# EAGLE design SerialCF (EAGLE 8.0.0)
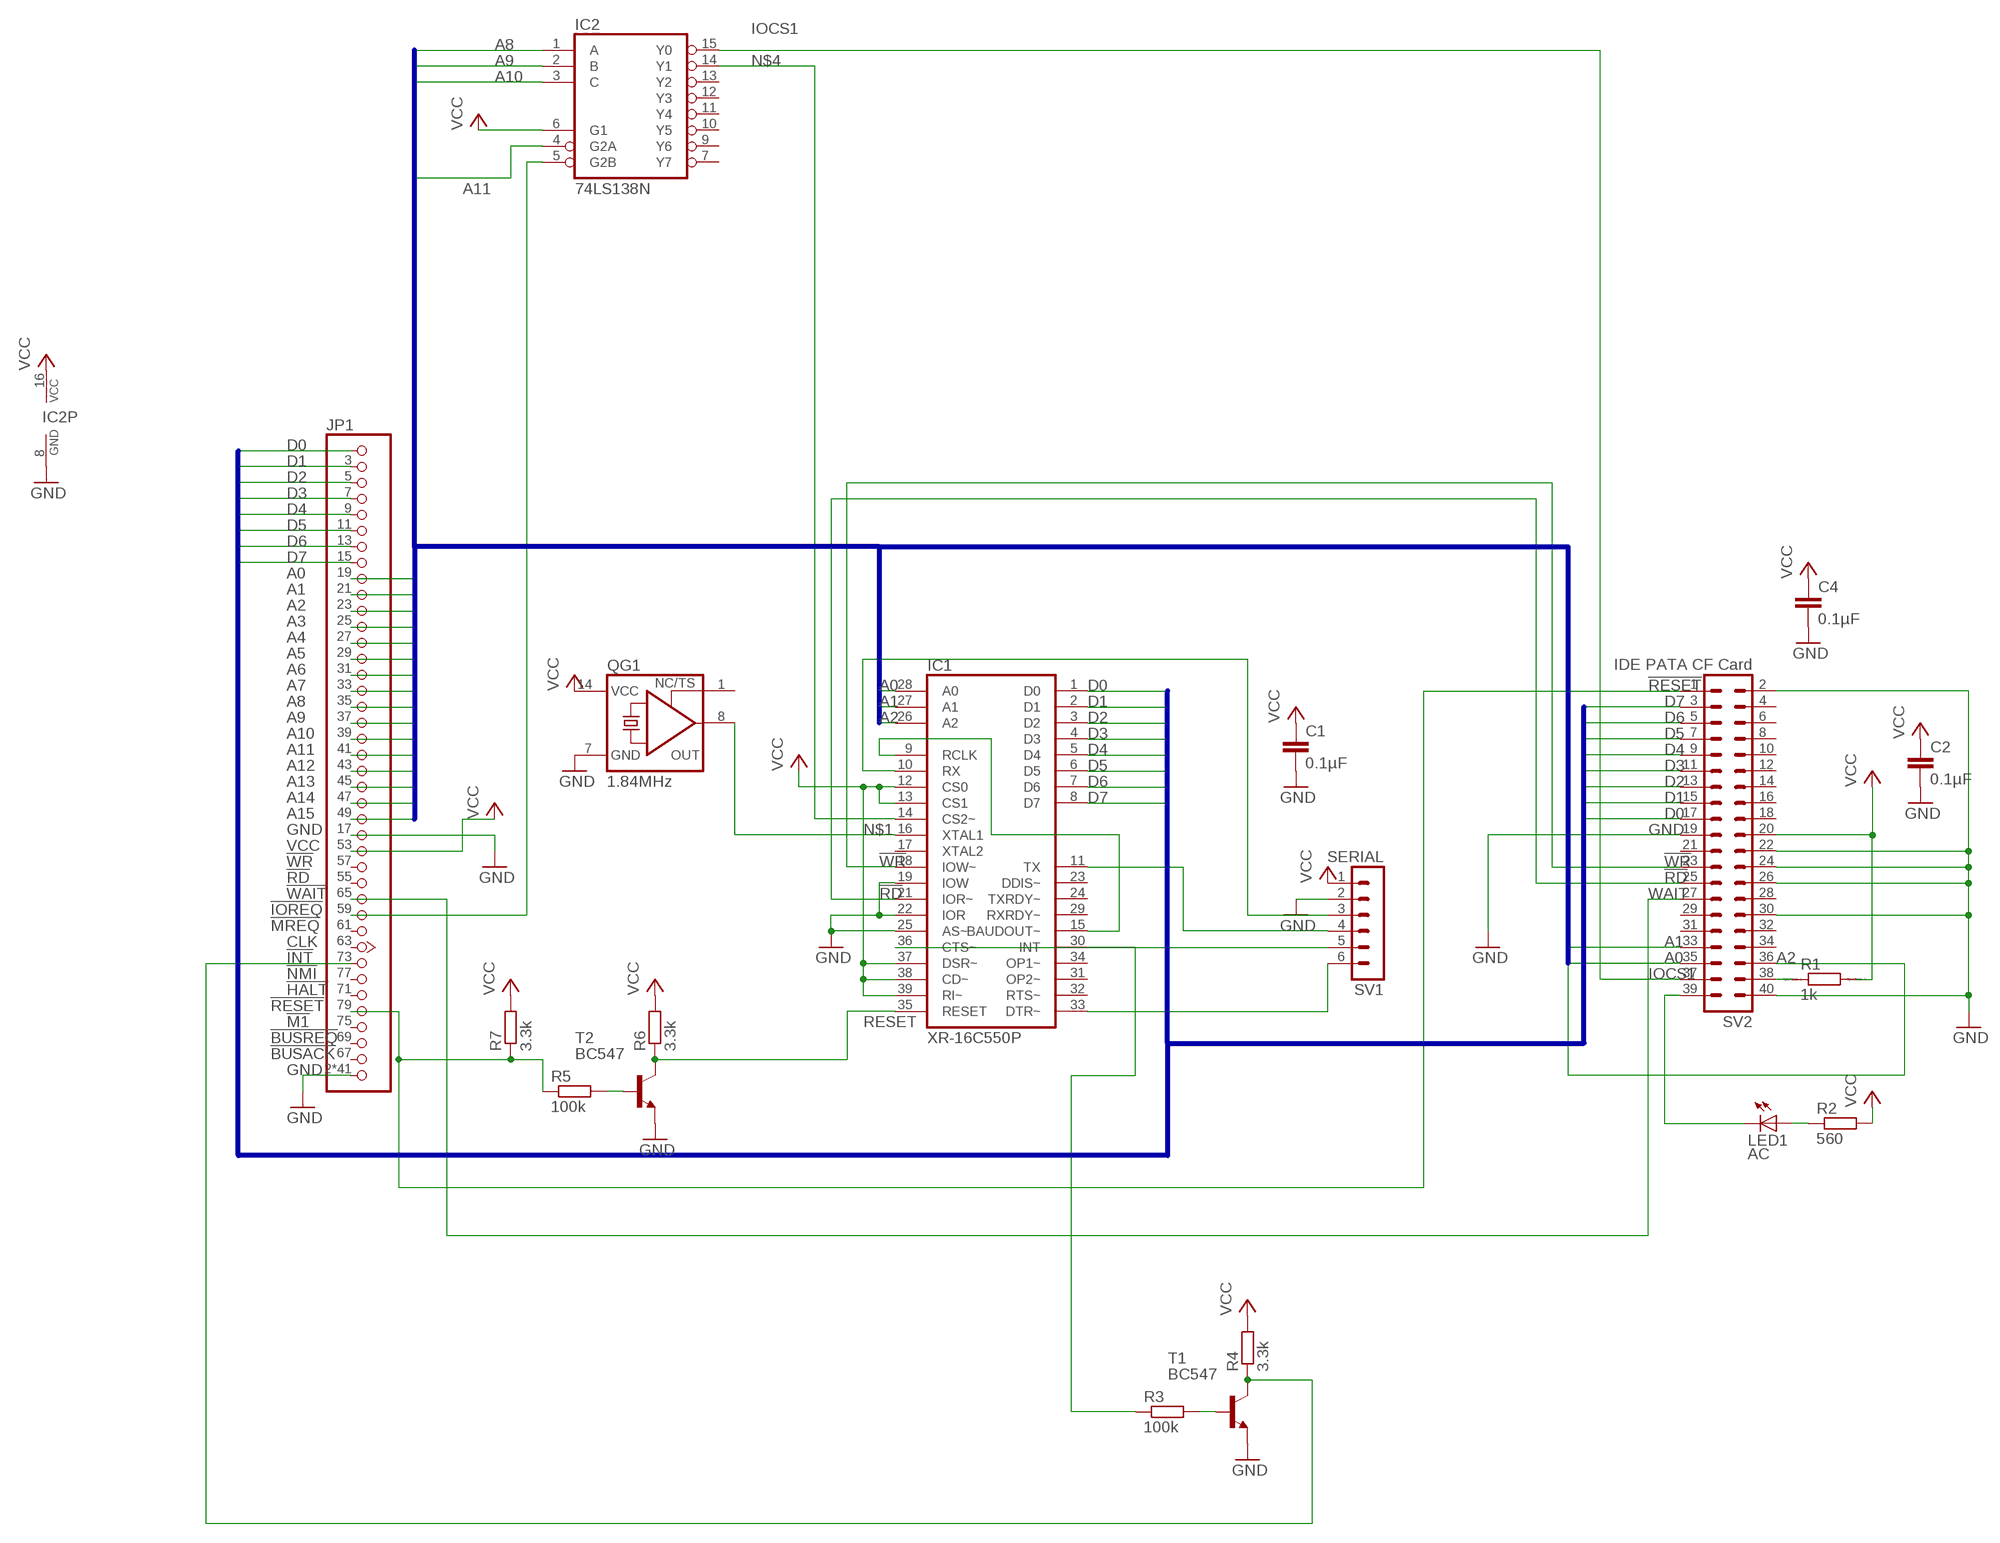
[diagram p0: schematic, sheet 1]

## Parts
C1  0.1µF  C5/2.5  [C5B2.5]
C2  0.1µF  C5/2.5  [C5B2.5]
C4  0.1µF  C5/2.5  [C5B2.5]
IC1  XR-16C550P  [DIL40]
IC2  74LS138N  [DIL16]
JP1  JEANNECTOR/90  [2X25/90]
LED1  AC  LED5MM  [LED5MM]
QG1  1.84MHz  XO-14  [DIL14S]
R1  1k  R0207/10  [0207/10]
R2  560  R-EU_0204/7  [0204/7]
R3  100k  R-EU_0207/2V  [0207/2V]
R4  3.3k  R-EU_0207/2V  [0207/2V]
R5  100k  R-EU_0207/2V  [0207/2V]
R6  3.3k  R-EU_0207/2V  [0207/2V]
R7  3.3k  R-EU_0207/2V  [0207/2V]
SV1  SERIAL  MA06-1  [MA06-1]
SV2  IDE PATA CF Card  MA20-2  [MA20-2]
T1  BC547  [TO92]
T2  BC547  [TO92]

## Nets
!RD: IC1.21(IOR~) SV2.25
!RESET: JP1.79(!RESET) R7.1 SV2.1
!WR: IC1.18(IOW~) SV2.23
A0: IC1.28(A0) JP1.19(A0) SV2.35
A1: IC1.27(A1) JP1.21(A1) SV2.33
A2: IC1.26(A2) JP1.23(A2) SV2.36
A3: JP1.25(A3)
A4: JP1.27(A4)
A5: JP1.29(A5)
A6: JP1.31(A6)
A7: JP1.33(A7)
A8: IC2.1(A) JP1.35(A8)
A9: IC2.2(B) JP1.37(A9)
A10: IC2.3(C) JP1.39(A10)
A11: IC2.4(G2A) JP1.41(A11)
A12: JP1.43(A12)
A13: JP1.45(A13)
A14: JP1.47(A14)
A15: JP1.49(A15)
D0: IC1.1(D0) JP1.1(D0) SV2.17
D1: IC1.2(D1) JP1.3(D1) SV2.15
D2: IC1.3(D2) JP1.5(D2) SV2.13
D3: IC1.4(D3) JP1.7(D3) SV2.11
D4: IC1.5(D4) JP1.9(D4) SV2.9
D5: IC1.6(D5) JP1.11(D5) SV2.7
D6: IC1.7(D6) JP1.13(D6) SV2.5
D7: IC1.8(D7) JP1.15(D7) SV2.3
GND: C1.2 C2.2 C4.2 IC1.19(IOW) IC1.22(IOR) IC1.25(AS~) IC2.8(GND) JP1.2(GND) JP1.4(GND) JP1.6(GND) JP1.8(GND) JP1.10(GND) JP1.12(GND) JP1.14(GND) JP1.16(GND) JP1.17(GND) JP1.18(GND) JP1.20(GND) JP1.22(GND) JP1.24(GND) JP1.26(GND) JP1.28(GND) JP1.30(GND) JP1.32(GND) JP1.34(GND) JP1.36(GND) JP1.38(GND) JP1.40(GND) JP1.42(GND) JP1.44(GND) JP1.46(GND) JP1.48(GND) JP1.50(GND) JP1.51(GND) JP1.52(GND) JP1.54(GND) JP1.56(GND) JP1.58(GND) JP1.60(GND) JP1.62(GND) JP1.64(GND) JP1.66(GND) JP1.68(GND) JP1.70(GND) JP1.72(GND) JP1.74(GND) JP1.76(GND) JP1.78(GND) JP1.80(GND) QG1.7(GND) SV1.2 SV2.2 SV2.19 SV2.22 SV2.24 SV2.26 SV2.30 SV2.40 T1.1(E) T2.1(E)
IOCS1: IC2.15(Y0) SV2.37
N$1: IC1.16(XTAL1) QG1.8(OUT)
N$2: LED1.K(C) SV2.39
N$3: LED1.A R2.1
N$4: IC1.14(CS2~) IC2.14(Y1)
N$5: IC2.5(G2B) JP1.59(!IOREQ)
N$6: R5.2 T2.2(B)
N$7: R6.1 T2.3(C)
N$8: R3.2 T1.2(B)
N$9: JP1.73(!INT) R4.1 T1.3(C)
N$10: IC1.30(INT) R3.1
N$11: IC1.11(TX) SV1.4
N$12: IC1.36(CTS~) SV1.5
N$13: IC1.9(RCLK) IC1.15(BAUDOUT~)
N$14: IC1.33(DTR~) SV1.6
N$15: IC1.10(RX) SV1.3
N$20: R1.1 SV2.38
RESET: IC1.35(RESET)
VCC: C1.1 C2.1 C4.1 IC1.12(CS0) IC1.13(CS1) IC1.37(DSR~) IC1.38(CD~) IC1.39(RI~) IC2.6(G1) IC2.16(VCC) JP1.53(VCC) QG1.14(VCC) R1.2 R2.2 R4.2 R6.2 R7.2 SV1.1 SV2.20
WAIT: JP1.65(!WAIT) SV2.27
Unconnected: IC1.17(XTAL2) IC1.23(DDIS~) IC1.24(TXRDY~) IC1.29(RXRDY~) IC1.31(OP2~) IC1.32(RTS~) IC1.34(OP1~) IC2.7(Y7) IC2.9(Y6) IC2.10(Y5) IC2.11(Y4) IC2.12(Y3) IC2.13(Y2) JP1.55(!RD) JP1.57(!WR) JP1.61(!MREQ) JP1.63(CLK) JP1.67(!BUSACK) JP1.69(!BUSRQ) JP1.71(!HALT) JP1.75(!M1) JP1.77(!NMI) QG1.1(TS) R5.1 SV2.4 SV2.6 SV2.8 SV2.10 SV2.12 SV2.14 SV2.16 SV2.18 SV2.21 SV2.28 SV2.29 SV2.31 SV2.32 SV2.34

## Buses
A[0..15]
D[0..7]

## Power pins joined to a net without a drawn wire
GND: IC1.20(GND)
VCC: IC1.40(VCC)

## Library data of the parts
C1 C2 C4 = capacitor-wima:C: CAPACITOR naming: grid - package width
IC1 = exar:XR-16C550P: UART/FIFO; OC_FARNELL: unknown; OC_NEWARK: 24R1445
IC2 = 74xx-eu:74*138: 3-line to 8-line DECODER/DEMULTIPLEXER
JP1 = jean:JEANNECTOR: PIN HEADER
LED1 = led:LED: LED OSRAM: - CHIPLED LG R971, LG N971, LY N971, LG Q971, LY Q971, LO R971, LY R971 LH N974, LH R974 LS Q976, LO Q976, LY Q976 LO Q996 - Hyper CHIPLED LW Q18S LB Q993, LB Q99A, LB R99A - SideLED LS A670, LO A670, LY A670, LG A670, LP A670 LB A673, LV A673, LT A673, LW A673 LH A674 LY A675 LS A676, LA A676, LO A676, LY A676, LW A676 LS A679, LY A679, LG A679 - Hyper Micro SIDELED® LS Y876, LA Y876, LO Y876, LY Y876 LT Y87S - SmartLED LW L88C, LW L88S LB L89C, LB L89S, LG L890 LS L89K, LO L89K, LY L89K LS L896, LA L896, LO L896, LY L896 - TOPLED LS T670, LO T670, LY T670, LG T670, LP T670 LSG T670, LSP T670, LSY T670, LOP T670, LYG T670 LG T671, LOG T671, LSG T671 LB T673, LV T673, LT T673, LW T673 LH T674 LS T676, LA T676, LO T676, LY T676, LB T676, LH T676, LSB T676, LW T676 LB T67C, LV T67C, LT T67C, LS T67K, LO T67K, LY T67K, LW E67C LS E67B, LA E67B, LO E67B, LY E67B, LB E67C, LV E67C, LT E67C LW T67C LS T679, LY T679, LG T679 LS T770, LO T770, LY T770, LG T770, LP T770 LB T773, LV T773, LT T773, LW T773 LH T774 LS E675, LA E675, LY E675, LS T675 LS T776, LA T776, LO T776, LY T776, LB T776 LHGB T686 LT T68C, LB T68C - Hyper Mini TOPLED® LB M676 - Mini TOPLED Santana® LG M470 LS M47K, LO M47K, LY M47K Source: http://www.osram.convergy.de LUXEON: - LUMILED® LXK2-PW12-R00, LXK2-PW12-S00, LXK2-PW14-U00, LXK2-PW14-V00 LXK2-PM12-R00, LXK2-PM12-S00, LXK2-PM14-U00 LXK2-PE12-Q00, LXK2-PE12-R00, LXK2-PE12-S00, LXK2-PE14-T00, LXK2-PE14-U00 LXK2-PB12-K00, LXK2-PB12-L00, LXK2-PB12-M00, LXK2-PB14-N00, LXK2-PB14-P00, LXK2-PB14-Q00 LXK2-PR12-L00, LXK2-PR12-M00, LXK2-PR14-Q00, LXK2-PR14-R00 LXK2-PD12-Q00, LXK2-PD12-R00, LXK2-PD12-S00 LXK2-PH12-R00, LXK2-PH12-S00 LXK2-PL12-P00, LXK2-PL12-Q00, LXK2-PL12-R00 Source: www.luxeon.com KINGBRIGHT: KA-3528ASYC Source: www.kingbright.com
QG1 = crystal:XO-: CRYSTAL; OC_FARNELL: unknown; OC_NEWARK: unknown
R1 = eagle-ltspice:R: RESISTOR, European symbol; MF: MULTICOMP; MPN: MCRE000037; OC_FARNELL: 1700237; SPICEMODEL: NONE; SPICEPREFIX: R
R2-R7 = resistor:R-EU_: RESISTOR, European symbol
SV1 = con-lstb:MA06-1: PIN HEADER; OC_FARNELL: unknown; OC_NEWARK: unknown
SV2 = con-lstb:MA20-2: PIN HEADER; OC_FARNELL: unknown; OC_NEWARK: unknown
T1 T2 = transistor:BC547: NPN TRANSISTOR

## Board
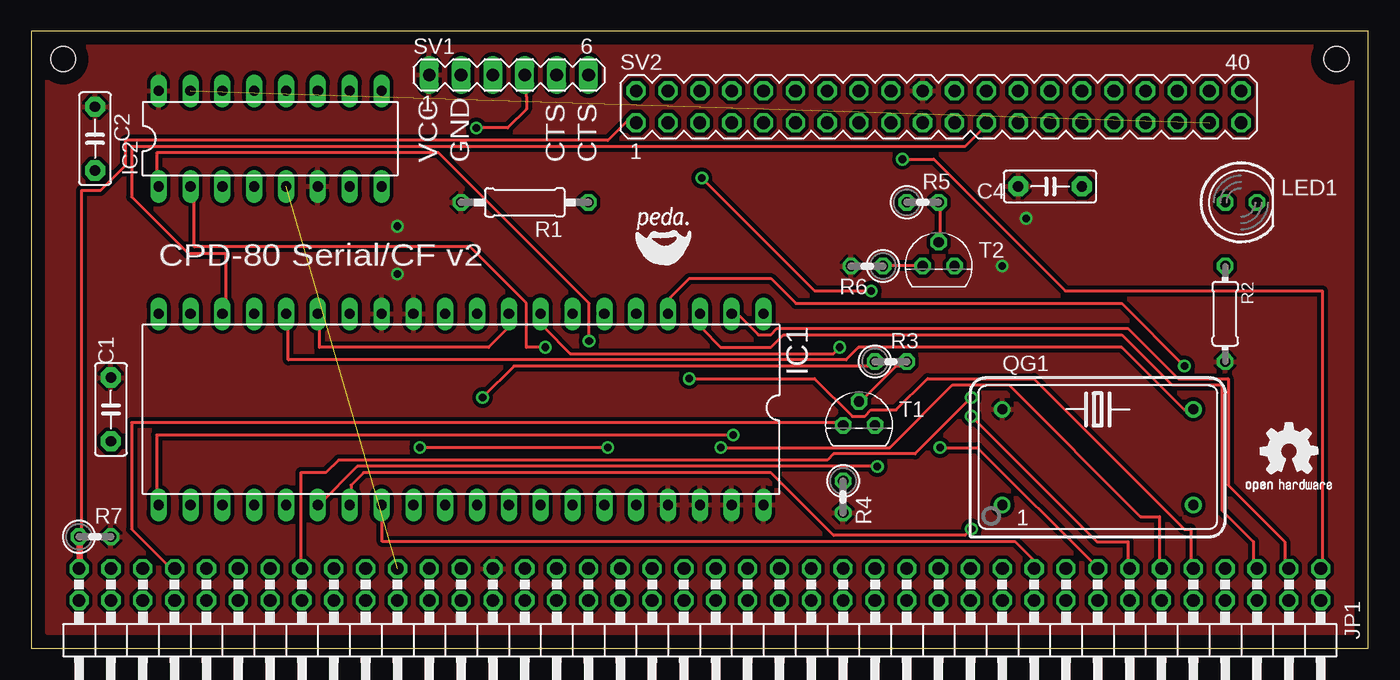
[diagram p1: board, top side]
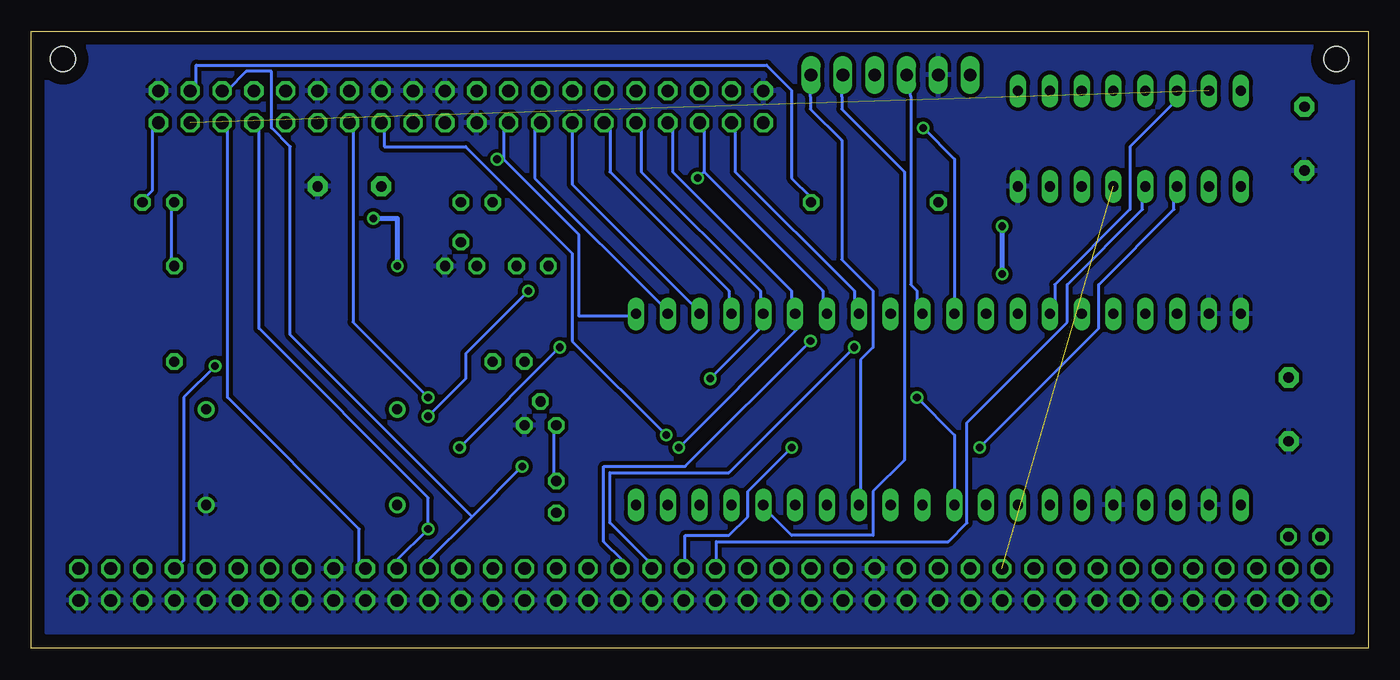
[diagram p2: board, bottom side, seen from below]

Size 106.66 x 49.2 mm. Coordinates in mm from the lower left corner, seen from the top.
Outline: 0,0 106.66,0 106.66,49.2 0,49.2 0,0
Copper layers (1*16): Top 0.035mm / dielectric 1.5mm / Bottom 0.035mm
Design rules "default": minimum track width 10mil, minimum drill 24mil, track to track 8mil, track to pad 8mil, pad to pad 8mil, via to via 8mil, smd to smd 8mil, copper to edge 40mil, drill to drill 8mil, minimum pad ring 10mil, minimum via ring 8mil, stop-mask expansion 4mil, vias tented up to drill 0mil, thermal gap 10mil
Holes 2 mm at 2.54,46.99 104.14,46.99

### Footprints (pad centres in the part's own frame; a part is rotated, then mirrored left to right if it is on the bottom)
C5B2.5 = drill 0.813 pad 1.6 octagon: 1 -2.54,0; 2 2.54,0
DIL40 = drill 0.813 long: 1 -24.13,-7.62; 2 -21.59,-7.62; 3 -19.05,-7.62; 4 -16.51,-7.62; 5 -13.97,-7.62; 6 -11.43,-7.62; 7 -8.89,-7.62; 8 -6.35,-7.62; 9 -3.81,-7.62; 10 -1.27,-7.62; 11 1.27,-7.62; 12 3.81,-7.62; 13 6.35,-7.62; 14 8.89,-7.62; 15 11.43,-7.62; 16 13.97,-7.62; 17 16.51,-7.62; 18 19.05,-7.62; 19 21.59,-7.62; 20 24.13,-7.62; 21 24.13,7.62; 22 21.59,7.62; 23 19.05,7.62; 24 16.51,7.62; 25 13.97,7.62; 26 11.43,7.62; 27 8.89,7.62; 28 6.35,7.62; 29 3.81,7.62; 30 1.27,7.62; 31 -1.27,7.62; 32 -3.81,7.62; 33 -6.35,7.62; 34 -8.89,7.62; 35 -11.43,7.62; 36 -13.97,7.62; 37 -16.51,7.62; 38 -19.05,7.62; 39 -21.59,7.62; 40 -24.13,7.62
DIL16 = drill 0.813 long: 1 -8.89,-3.81; 2 -6.35,-3.81; 3 -3.81,-3.81; 4 -1.27,-3.81; 5 1.27,-3.81; 6 3.81,-3.81; 7 6.35,-3.81; 8 8.89,-3.81; 9 8.89,3.81; 10 6.35,3.81; 11 3.81,3.81; 12 1.27,3.81; 13 -1.27,3.81; 14 -3.81,3.81; 15 -6.35,3.81; 16 -8.89,3.81
2X25/90 = drill 1.016 octagon: 1 -29.21,-6.35; 2 -29.21,-3.81; 3 -26.67,-6.35; 4 -26.67,-3.81; 5 -24.13,-6.35; 6 -24.13,-3.81; 7 -21.59,-6.35; 8 -21.59,-3.81; 9 -19.05,-6.35; 10 -19.05,-3.81; 11 -16.51,-6.35; 12 -16.51,-3.81; 13 -13.97,-6.35; 14 -13.97,-3.81; 15 -11.43,-6.35; 16 -11.43,-3.81; 17 -8.89,-6.35; 18 -8.89,-3.81; 19 -6.35,-6.35; 20 -6.35,-3.81; 21 -3.81,-6.35; 22 -3.81,-3.81; 23 -1.27,-6.35; 24 -1.27,-3.81; 25 1.27,-6.35; 26 1.27,-3.81; 27 3.81,-6.35; 28 3.81,-3.81; 29 6.35,-6.35; 30 6.35,-3.81; 31 8.89,-6.35; 32 8.89,-3.81; 33 11.43,-6.35; 34 11.43,-3.81; 35 13.97,-6.35; 36 13.97,-3.81; 37 16.51,-6.35; 38 16.51,-3.81; 39 19.05,-6.35; 40 19.05,-3.81; 41 21.59,-6.35; 42 21.59,-3.81; 43 24.13,-6.35; 44 24.13,-3.81; 45 26.67,-6.35; 46 26.67,-3.81; 47 29.21,-6.35; 48 29.21,-3.81; 49 31.75,-6.35; 50 31.75,-3.81; 51 34.29,-6.35; 52 34.29,-3.81; 53 36.83,-6.35; 54 36.83,-3.81; 55 39.37,-6.35; 56 39.37,-3.81; 57 41.91,-6.35; 58 41.91,-3.81; 59 44.45,-6.35; 60 44.45,-3.81; 61 46.99,-6.35; 62 46.99,-3.81; 63 49.53,-6.35; 64 49.53,-3.81; 65 52.07,-6.35; 66 52.07,-3.81; 67 54.61,-6.35; 68 54.61,-3.81; 69 57.15,-6.35; 70 57.15,-3.81; 71 59.69,-6.35; 72 59.69,-3.81; 73 62.23,-6.35; 74 62.23,-3.81; 75 64.77,-6.35; 76 64.77,-3.81; 77 67.31,-6.35; 78 67.31,-3.81; 79 69.85,-6.35; 80 69.85,-3.81
LED5MM = drill 0.813 octagon: A -1.27,0; K 1.27,0
DIL14S = drill 0.813: 1 -7.62,-3.81; 7 7.62,-3.81; 8 7.62,3.81; 14 -7.62,3.81
0207/10 = drill 0.813 octagon: 1 -5.08,0; 2 5.08,0
0204/7 = drill 0.813 octagon: 1 -3.81,0; 2 3.81,0
0207/2V = drill 0.813 octagon: 1 -1.27,0; 2 1.27,0
MA06-1 = drill 1.016 long: 1 -6.35,0; 2 -3.81,0; 3 -1.27,0; 4 1.27,0; 5 3.81,0; 6 6.35,0
MA20-2 = drill 1.016 octagon: 1 -24.13,-1.27; 2 -24.13,1.27; 3 -21.59,-1.27; 4 -21.59,1.27; 5 -19.05,-1.27; 6 -19.05,1.27; 7 -16.51,-1.27; 8 -16.51,1.27; 9 -13.97,-1.27; 10 -13.97,1.27; 11 -11.43,-1.27; 12 -11.43,1.27; 13 -8.89,-1.27; 14 -8.89,1.27; 15 -6.35,-1.27; 16 -6.35,1.27; 17 -3.81,-1.27; 18 -3.81,1.27; 19 -1.27,-1.27; 20 -1.27,1.27; 21 1.27,-1.27; 22 1.27,1.27; 23 3.81,-1.27; 24 3.81,1.27; 25 6.35,-1.27; 26 6.35,1.27; 27 8.89,-1.27; 28 8.89,1.27; 29 11.43,-1.27; 30 11.43,1.27; 31 13.97,-1.27; 32 13.97,1.27; 33 16.51,-1.27; 34 16.51,1.27; 35 19.05,-1.27; 36 19.05,1.27; 37 21.59,-1.27; 38 21.59,1.27; 39 24.13,-1.27; 40 24.13,1.27
TO92 = drill 0.813 octagon: 1 1.27,0; 2 0,1.905; 3 -1.27,0

### Placement (x,y rotation side)
C1  6.35,19.05 270 top
C2  5.08,40.64 270 top
C4  81.28,36.83 0 top
IC1  34.29,19.05 180 top
IC2  19.05,40.64 0 top
JP1  73.66,0 180 top
LED1  96.52,35.56 0 top
QG1  85.09,15.24 0 top
R1  39.37,35.56 180 top
R2  95.25,26.67 270 top
R3  68.58,22.86 0 top
R4  64.77,12.06 270 top
R5  71.12,35.56 0 top
R6  66.67,30.48 180 top
R7  5.08,8.89 0 top
SV1  38.1,45.72 0 top
SV2  72.39,43.18 0 top
T1  66.04,17.78 0 top
T2  72.39,30.48 0 top
U$1  [OSHW2]  96.52,11.43 0 top

### Tracks (layer width: path | path; a pad name or v marks a point on that pad's centre or on a via)
!RD  (via drill 0.61)
  Top 0.254: v56,17 10,17 10,11.5 IC1.21
  Bottom 0.254: v56,17 63.5,24.5 63.5,31.5 72,40 78.5,40 78.5,41.5 SV2.25
!RESET
  Top 0.254: JP1.79 4,6.5 4,36.5 5.5,36.5 7.5,38.5 7.5,40.5 46,40.5 47.5,42 48,42 SV2.1
  Top 0.406: JP1.79 R7.1
!WR
  Top 0.254: IC1.18 15.5,27 15.5,31.5 12.5,31.5 8,36 8,40 74.5,40 76,41.5 SV2.23
A0
  Top 0.254: IC1.28 28,11 28,8.5 78.5,8.5 80.5,6.5 JP1.19
  Bottom 0.254: SV2.35 91,41.5 91,20 80.5,9.5 80.5,6.5 JP1.19
A1  (via drill 0.61)
  Top 0.254: v75,9.5 74.5,9 64,9 59,14 26.5,14 25.5,13 25.5,11.5 IC1.27
  Bottom 0.254: JP1.21 77.5,6.5 77.5,7 v75,9.5 75,12 88.5,25.5 88.5,41.5 SV2.33
A2  (via drill 0.61)
  Top 0.254: v67.5,14.5 26,14.5 23,11.5 IC1.26
  Bottom 0.254: 71.5,10.5 75,7 75,6.5 JP1.23 | 71.5,10.5 v67.5,14.5 | 71.5,10.5 86,25 86,40 87.5,41.5 87.5,46 89.5,46 91,44.5 SV2.36
A8  (via drill 0.61)
  Top 0.254: v44.5,24.5 44.5,27.5 32.5,39.5 10,39.5 10,37 IC2.1
  Bottom 0.254: v44.5,24.5 54.5,14.5 61,14.5 61,8.5 59.5,7 59.5,6.5 JP1.35
A9  (via drill 0.61)
  Top 0.254: v41,24 39.5,24 39.5,27.5 35,32 13,32 13,36.5 IC2.2
  Bottom 0.254: v41,24 51,14 60.5,14 60.5,10 57.5,7 57.5,6.5 JP1.37
A10  (via drill 0.61)
  Top 0.254: v46,16 v31,16
  Bottom 0.254: v31,16 21.5,25.5 21.5,29 15.5,35 15.5,36.5 IC2.3 | v46,16 49.5,12.5 49.5,10.5 51,9 54.5,9 54.5,6.5 JP1.39
A11
  Bottom 0.254: IC2.4 18,36.5 18,35 24,29 24,26 32,18 32,10 33.5,8.5 52,8.5 52,6.5 JP1.41
D0  (via drill 0.61)
  Top 0.254: v69.5,39 72,39 82.5,28.5 103,28.5 103,6.5 JP1.1
  Bottom 0.254: 69,39 63,33 63,26.5 58.5,26.5 IC1.1 | 69,39 69,41.5 SV2.17 | 69,39 v69.5,39
D1
  Top 0.254: JP1.3 100,6.5 100,8.5 95.5,13 95.5,21.5 91.5,21.5 87.5,25.5 59.5,25.5 59,25 58,25 56.5,26.5 56,26.5 IC1.2
  Bottom 0.254: IC1.2 56,27 66.5,37.5 66.5,41.5 SV2.15
D2
  Top 0.254: JP1.5 97.5,6.5 97.5,8.5 95,11 95,21 91,21 87,25 60,25 59,24 55,24 53.5,25.5 53.5,26.5 IC1.3
  Bottom 0.254: SV2.13 63.5,37 53.5,27 IC1.3
D3  (via drill 0.61)
  Top 0.254: v92,22.5 87,27.5 61,27.5 59,29.5 52.5,29.5 51,28 51,27 IC1.4
  Bottom 0.254: IC1.4 51,27 51,28.5 60.5,38 60.5,41.5 SV2.11 | v92,22.5 94.5,20 94.5,7 95,6.5 JP1.7
D4  (via drill 0.61)
  Top 0.254: v52.5,21.5 62.5,21.5 65.5,18.5 66.5,18.5 67,19 69,19 71.5,21.5 80,21.5 92,9.5 92.5,9.5 92.5,6.5 JP1.9
  Bottom 0.254: SV2.9 58,41.5 58,38 48.5,28.5 48.5,27 IC1.5 48.5,26.5 48.5,25.5 v52.5,21.5
D5  (via drill 0.61)
  Top 0.254: v55,16 68.5,16 73.5,21 78,21 88.5,10.5 90,10.5 90,6.5 JP1.11
  Bottom 0.254: SV2.7 55.5,41.5 55.5,38 46,28.5 46,27 IC1.6 45.5,26.5 45.5,25.5 v55,16
D6  (via drill 0.61)
  Top 0.254: v75,18.5 85,8.5 87.5,8.5 87.5,6.5 JP1.13 | v67,28.5 62.5,28.5 v53.5,37.5
  Bottom 0.254: 53,38 43.5,28.5 43.5,27 IC1.7 | 53,38 53,41.5 SV2.5 | v75,18.5 72,21.5 72,23.5 v67,28.5 | 53,38 v53.5,37.5
D7  (via drill 0.61)
  Top 0.254: v72.5,16 75.5,16 85,6.5 JP1.15 | v64.5,24 64,23.5 43,23.5 41,25.5 41,26.5 IC1.8
  Bottom 0.254: IC1.8 41,27 41,28.5 50.5,38 50.5,41.5 SV2.3 | v64.5,24 v72.5,16
GND
  pour Bottom (isolate 0.305): 1.27,48.26 1.27,1.27 105.41,1.27 105.41,48.26
IOCS1  (1 unrouted)
N$1
  Top 0.254: IC1.16 20.5,26.5 20.5,23 65,23 66,24 87,24 92,19 92.5,19 QG1.8
N$2
  Bottom 0.254: LED1.K 97.5,36 97,36.5 97,41.5 SV2.39
N$3
  Bottom 0.254: R2.1 95.5,30.5 95.5,35.5 LED1.A
N$4
  Bottom 0.254: IC1.14 25,27 25,29 19,35 19,40 15.5,43.5 15.5,44 IC2.14
N$5  (1 unrouted)
N$6
  Top 0.254: T2.2 72.5,32.5 72.5,35.5 R5.2
N$7
  Top 0.254: R6.1 68,30.5 71,30.5 T2.3
N$8
  Top 0.254: T1.2 66.5,20 69,22.5 69.5,22.5 R3.2
N$9
  Top 0.254: JP1.73 11,6.5 8,9.5 8,18 64.5,18 T1.3
  Bottom 0.254: R4.1 65,13.5 65,17.5 T1.3
N$10  (via drill 0.61)
  Top 0.254: v36,20 38.5,22.5 67,22.5 R3.1
  Bottom 0.254: v36,20 33,17 33,11.5 IC1.30
N$11  (via drill 0.61)
  Top 0.254: v35.5,41.5 38,41.5 39.5,43 39.5,44 SV1.4
  Bottom 0.254: v35.5,41.5 33,39 33,27 IC1.11
N$12
  Bottom 0.254: IC1.36 48,11 46,9 39.5,9 39.5,12.5 37,15 37,38 42,43 42,44 SV1.5
N$13
  Top 0.254: IC1.15 23,26.5 23,24 36.5,24 38,25.5 38,26.5 IC1.9
N$14
  Bottom 0.254: IC1.33 40.5,11.5 40.5,23 39.5,24 39.5,28.5 42,31 42,40.5 44.5,43 44.5,44 SV1.6
N$15
  Bottom 0.254: IC1.10 36,27 36,28.5 36.5,29 36.5,44 SV1.3
N$20
  Bottom 0.254: R1.1 44.5,36 46,37.5 46,44.5 48,46.5 93.5,46.5 93.5,44.5 SV2.38
VCC  (via drill 0.6)
  Bottom 0.406: v79.38,34.29 77.47,34.29 v77.47,30.48 | v29.21,33.66 v29.21,29.84
  pour Top (isolate 0.305): 1.27,48.26 1.27,1.27 105.41,1.27 105.41,48.26
WAIT  (via drill 0.61)
  Top 0.254: v75,20 70.5,15.5 64,15.5 63.5,15 24.5,15 23.5,14 21.5,14 21.5,6.5 JP1.65
  Bottom 0.254: v75,20 81,26 81,41.5 SV2.27

### Text on the board
tPlace: VCC | GND | CTS | CTS | CPD-80 Serial/CF v2
tValues: RX | TX